# EAGLE design tiips_tag (EAGLE 7.7.0)
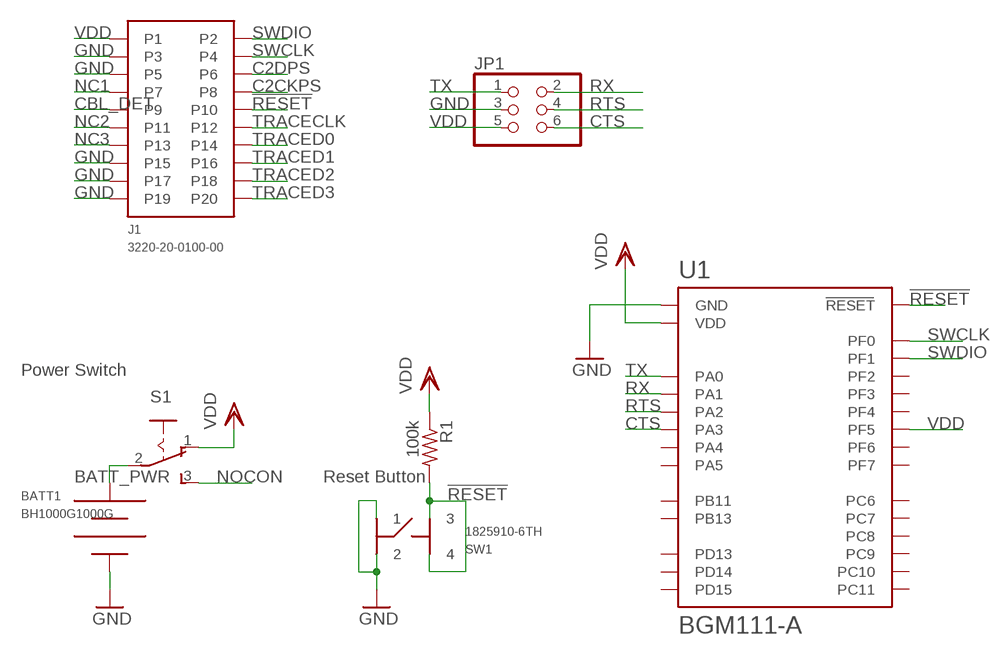
[diagram p0: schematic, sheet 1]

## Parts
BATT1  BH1000G1000G  [BH]
J1  3220-20-0100-00  [3220-20-0100-00]
JP1  PINHD-2X3  [2X03]
R1  100k  R-US_0309/10  [0309/10]
S1  M251  [M251]
SW1  1825910-6TH  [1825910-6]
U1  BGM111-A  [BGM111-A]

## Nets
!RESET: J1.P10 R1.2 SW1.3 SW1.4 U1.RESET
BATT_PWR: BATT1.2(3V) S1.2(P)
C2CKPS: J1.P8
C2DPS: J1.P6
CBL_DET: J1.P9
CTS: JP1.6 U1.PA3
GND: BATT1.1(GND) J1.P3 J1.P5 J1.P15 J1.P17 J1.P19 JP1.3 SW1.1 SW1.2 U1.GND U1.GND@2(GND) U1.GND@3(GND) U1.GND@4(GND)
NC1: J1.P7
NC2: J1.P11
NC3: J1.P13
NOCON: S1.3(S)
RTS: JP1.4 U1.PA2
RX: JP1.2 U1.PA1
SWCLK: J1.P4 U1.PF0
SWDIO: J1.P2 U1.PF1
TRACECLK: J1.P12
TRACED0: J1.P14
TRACED1: J1.P16
TRACED2: J1.P18
TRACED3: J1.P20
TX: JP1.1 U1.PA0
VDD: J1.P1 JP1.5 R1.1 S1.1(O) U1.PF5 U1.VDD
Unconnected: U1.PA4 U1.PA5 U1.PB11 U1.PB13 U1.PC6 U1.PC7 U1.PC8 U1.PC9 U1.PC10 U1.PC11 U1.PD13 U1.PD14 U1.PD15 U1.PF2 U1.PF3 U1.PF4 U1.PF6 U1.PF7

## Notes on the sheet
- Power Switch
- Reset Button

## Library data of the parts
BATT1 = tiips:BH1000G: Battery holder for CR2477
J1 = tiips:3220-20-0100-00: 20 pin 0.05" header
JP1 = pinhead:PINHD-2X3: PIN HEADER
R1 = resistor:R-US_: RESISTOR, American symbol
S1 = switch:M251: SLIDING SWITCH Mors, distributor Buerklin, 11G702
SW1 = tiips:1825910-6: Push button
U1 = sf-bluegiga:BGM111: Bluetooth 4.1 (4.2 ready) low-energy module (Bluetooth Smart) - BGM111-A variant has an on-module ceramic chip antenna. BGM111-A variant includes keepout/restrict area. Antenna edge of the module should be flush up against the edge of the PCB. See datasheet for variant layout details. IT IS EXTREMELY IMPORTANT THAT YOU FOLLOW THE LAYOUT GUIDELINES FOR THIS MODULE IN ORDER TO ENSURE MAXIMUM RANGE. THIS MEANS THAT YOU NEED A SOLID GROUND PLANE EXTENDING IDEALLY 17 mm ON THE LEFT AND RIGHT SIDES OF THE MODULE, AS SHOWN IN THE DATASHEET. The Silicon Labs Blue Gecko BGM111 Bluetooth® Smart module integrates our next generation wireless SoC with a complete Bluetooth Smart software stack and antenna to provide a complete, pre-certified plug-and-play Bluetooth Smart solution. It solves one of the major customer roadblocks for fast time-to-market as it integrates antenna, software and RF certifications, saving months of engineering effort and testing. https://www.silabs.com/products/wireless/bluetooth/Pages/BGM111-bluetooth-smart-module.aspx https://github.com/jrowberg/sf-oshw Last updated 2015-09-02 by Jeff Rowberg <jeff@rowberg.net>; ANTANNA: On-module ceramic chip antenna

## Board
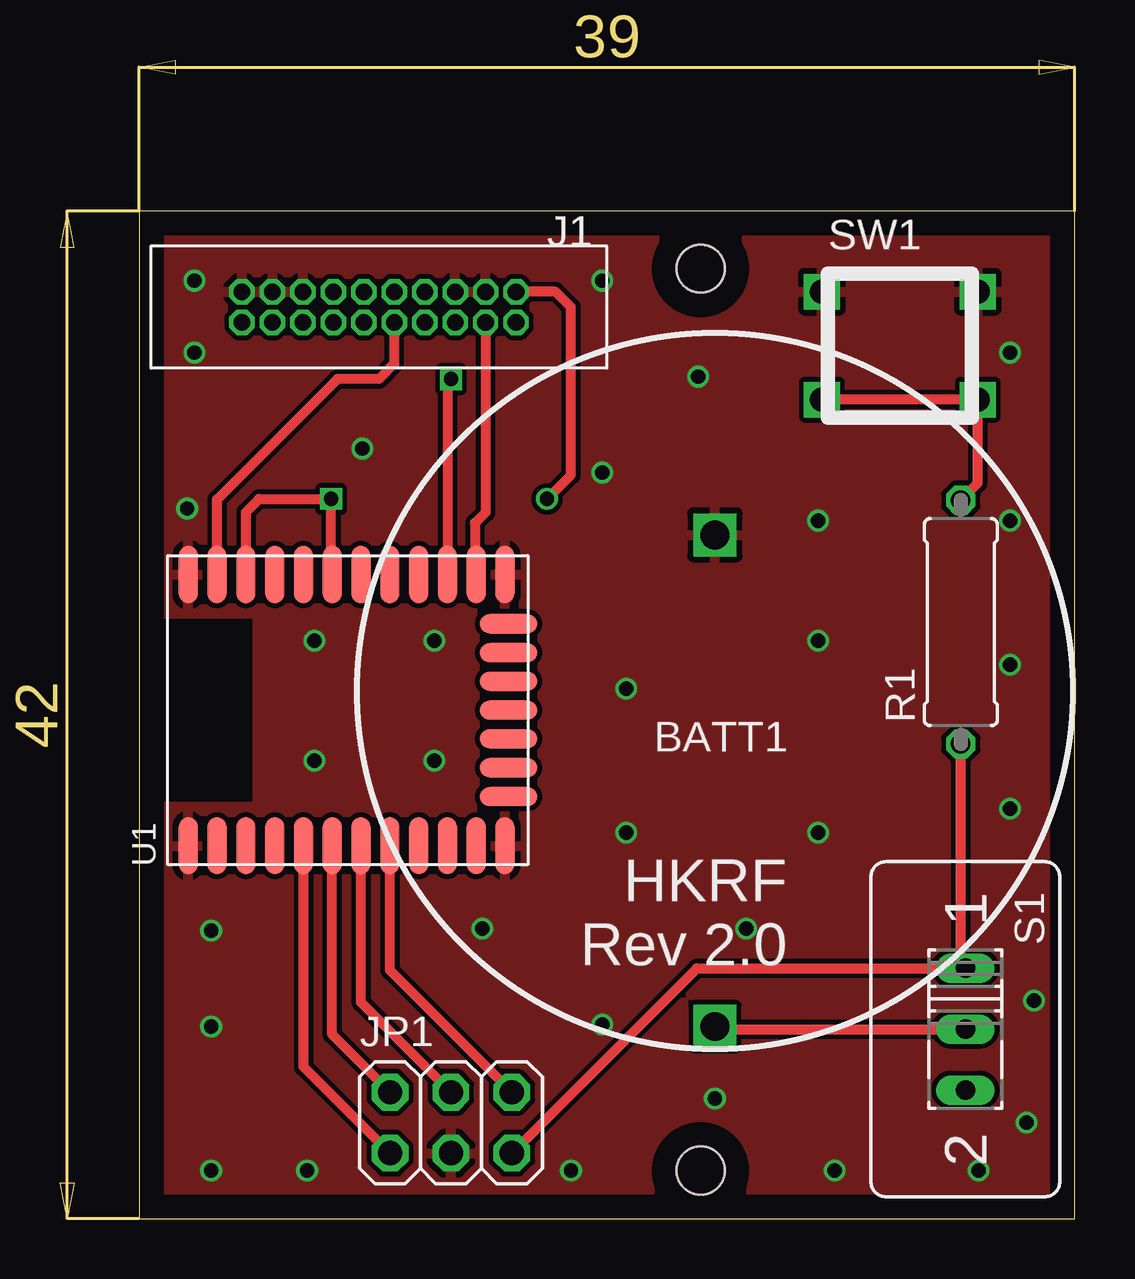
[diagram p1: board, top side]
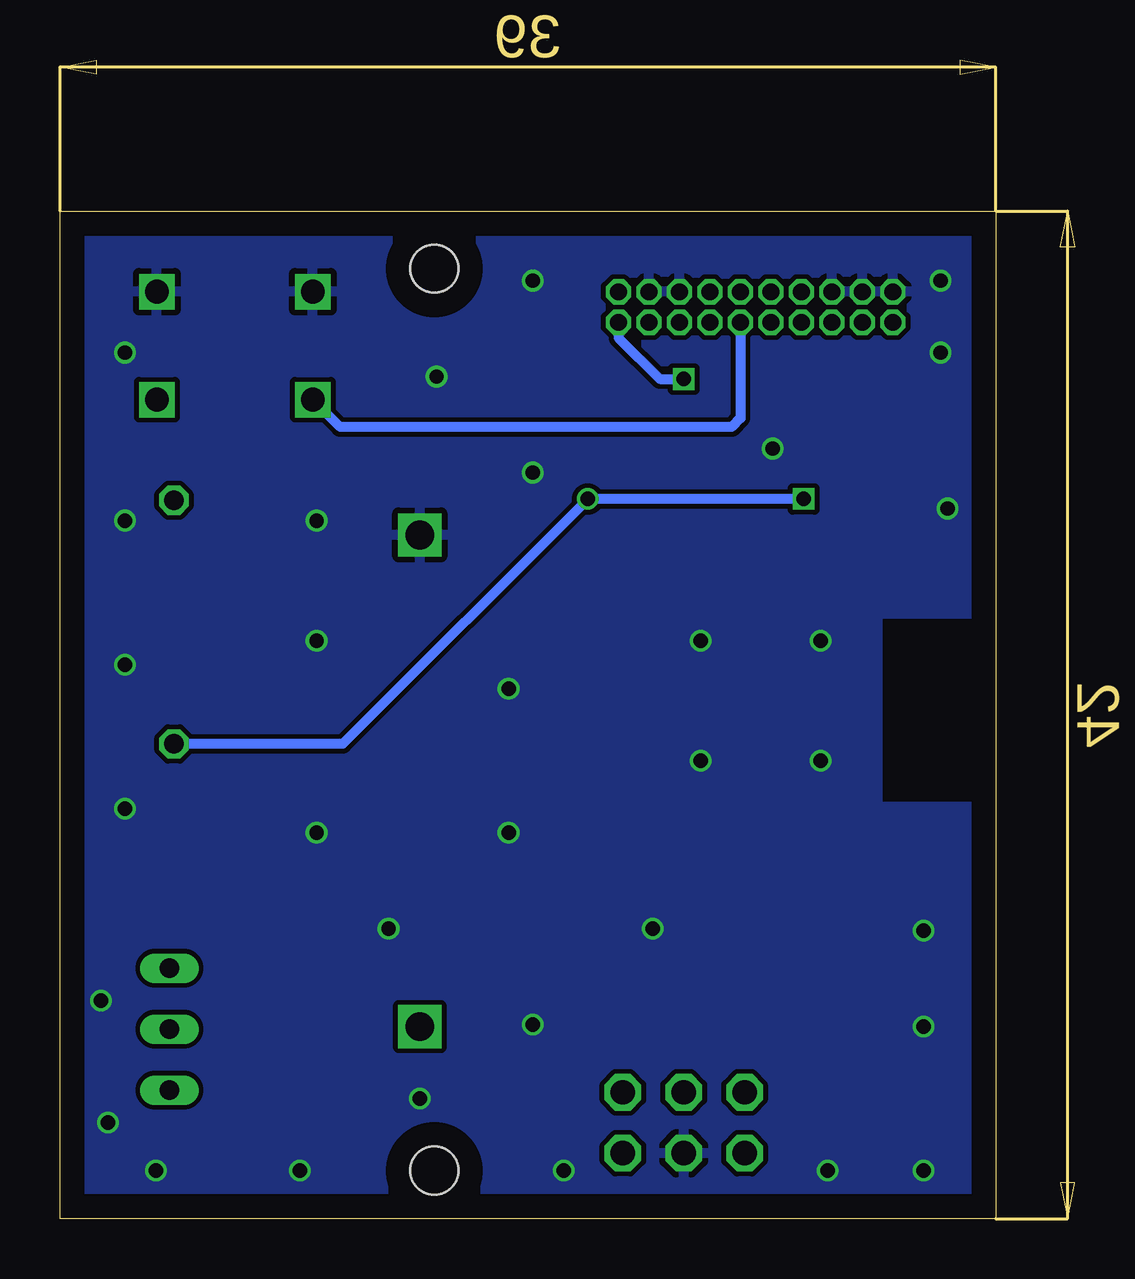
[diagram p2: board, bottom side, seen from below]

Size 39 x 42 mm. Coordinates in mm from the lower left corner, seen from the top.
Outline: 0,0 39,0 39,42 0,42 0,0
Copper layers (1*16): Top 0.035mm / dielectric 1.5mm / Bottom 0.035mm
Design rules "default *": minimum track width 10mil, minimum drill 16mil, track to track 8mil, track to pad 8mil, pad to pad 8mil, via to via 8mil, smd to smd 8mil, copper to edge 40mil, drill to drill 15mil, minimum pad ring 0mil, minimum via ring 0mil, stop-mask expansion 4mil, vias tented up to drill 0mil, thermal gap 10mil
Holes 2 mm at 23.4,2 23.4,39.6

### Footprints (pad centres in the part's own frame; a part is rotated, then mirrored left to right if it is on the bottom)
BH = drill 1.2 square: 1 0,6.502; 2 0,-13.995
3220-20-0100-00 = drill 0.7 pad 0.813 octagon: P1 -5.715,-0.635; P2 -5.715,0.635; P3 -4.445,-0.635; P4 -4.445,0.635; P5 -3.175,-0.635; P6 -3.175,0.635; P7 -1.905,-0.635; P8 -1.905,0.635; P9 -0.635,-0.635; P10 -0.635,0.635; P11 0.635,-0.635; P12 0.635,0.635; P13 1.905,-0.635; P14 1.905,0.635; P15 3.175,-0.635; P16 3.175,0.635; P17 4.445,-0.635; P18 4.445,0.635; P19 5.715,-0.635; P20 5.715,0.635
2X03 = drill 1.016 octagon: 1 -2.54,-1.27; 2 -2.54,1.27; 3 0,-1.27; 4 0,1.27; 5 2.54,-1.27; 6 2.54,1.27
0309/10 = drill 0.813 octagon: 1 -5.08,0; 2 5.08,0
M251 = drill 0.813 long: 1 -2.54,0; 2 0,0; 3 2.54,0
1825910-6 = drill 0.99 square: 1 -3.25,2.25; 2 3.25,2.25; 3 -3.25,-2.25; 4 3.25,-2.25
BGM111-A = smd 2.4 x 0.8: GND -5.65,6.65; GND@2 -5.65,-6.55; GND@3 5.65,-6.55; GND@4 5.65,6.65; PA0 -5.65,1.85; PA1 -5.65,0.65; PA2 -5.65,-0.55; PA3 -5.65,-1.75; PA4 -5.65,-2.95; PA5 -5.65,-4.15; PB11 -5.65,-5.35; PD13 -5.65,5.45; PD14 -5.65,4.25; PD15 -5.65,3.05; PF0 5.65,-5.35; PF1 5.65,-4.15; PF2 5.65,-2.95; PF3 5.65,-1.75; PF4 5.65,-0.55; PF5 5.65,0.65; PF6 5.65,1.85; PF7 5.65,3.05; RESET 5.65,5.45; VDD 5.65,4.25 | smd 0.8 x 2.4: PB13 -3.6,-6.7; PC6 -2.4,-6.7; PC7 -1.2,-6.7; PC8 0,-6.7; PC9 1.2,-6.7; PC10 2.4,-6.7; PC11 3.6,-6.7

### Placement (x,y rotation side)
BATT1  24,22 0 top
J1  10,38 180 top
JP1  13,4 0 top
R1  34.25,24.87 90 top
S1  34.44,7.9 270 top
SW1  31.71,36.39 0 top
U1  8.7,21.2 90 top

### Tracks (layer width: path | path; a pad name or v marks a point on that pad's centre or on a via)
!RESET
  Top 0.406: R1.2 34.96,30.66 SW1.4 SW1.3 | U1.RESET 3.25,29.98 8.27,35 10,35 10.63,35.63 J1.P10
  Bottom 0.406: J1.P10 10.63,33.37 11,33 27.32,33 SW1.3
BATT_PWR
  Top 0.406: BATT1.2 24.11,7.9 S1.2
CTS
  Top 0.406: JP1.6 10.45,10.36 U1.PA3
GND  (via drill 0.6)
  other vias: 3,12 3,8 3,2 7,2 18,2 24,5 29,2 35,2 37,4 37.3,9.1 36.3,17.1 36.3,23.1 36.3,29.1 36.3,36.1 23.3,35.1 19.3,39.1 2.3,39.1 2.3,36.1 2,29.6 7.3,24.1 12.3,24.1 12.3,19.1 7.3,19.1 9.3,32.1 14.3,12.1 19.3,8.1 25.3,12.1 20.3,16.1 20.3,22.1 28.3,16.1 28.3,24.1 28.3,29.1 19.3,31.1
  pour Top: 0,0 0,42 39,42 39,0
  pour Bottom: 0,0 0,42 39,42 39,0
RTS
  Top 0.406: JP1.4 9.25,9.02 U1.PA2
RX
  Top 0.406: JP1.2 8.05,7.68 U1.PA1
SWCLK
  Top 0.406: J1.P4 14.45,29.45 14,29 14,26.9 U1.PF0
SWDIO  (via drill 0.6)
  Top 0.406: v13,35 12.85,34.85 U1.PF1
  Bottom 0.406: 13.35,35 v13,35 14,35 15.71,36.72 J1.P2
TX
  Top 0.406: JP1.1 6.85,6.34 U1.PA0
VDD  (via drill 0.6)
  Top 0.406: R1.1 34.25,10.63 S1.1 23.25,10.44 JP1.5 | U1.VDD 4.45,29.45 5,30 v8,30 8,26.9 U1.PF5 | v17,30 18,31 18,38 17.36,38.63 J1.P1
  Bottom 0.406: v8,30 v17,30 27.21,19.79 R1.1

### Text on the board
tPlace: HKRF / Rev 2.0